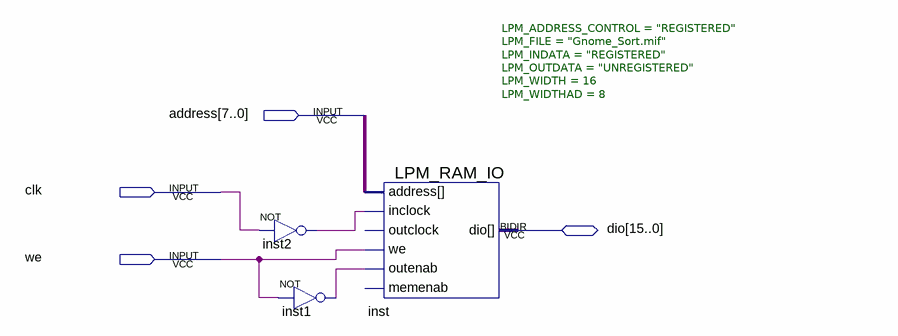
[diagram p0: schematic sheet]
// Quartus schematic Instruction_Memory.bdf as structural Verilog: 3 symbols, 4 pins
module Instruction_Memory (
  input  [7:0] address,
  input  clk,
  input  we,
  inout  [15:0] dio
);

  wire inst1_out, inst2_out;

  not inst2 (inst2_out, clk);
  not inst1 (inst1_out, we);
  LPM_RAM_IO #(.LPM_ADDRESS_CONTROL("REGISTERED"), .LPM_FILE("Gnome_Sort.mif"), .LPM_INDATA("REGISTERED"), .LPM_OUTDATA("UNREGISTERED"), .LPM_WIDTH(16), .LPM_WIDTHAD(8)) inst (
    .address(address), .inclock(inst2_out), .we(we), .outenab(inst1_out), .dio(dio));  // open: outclock, memenab
endmodule
